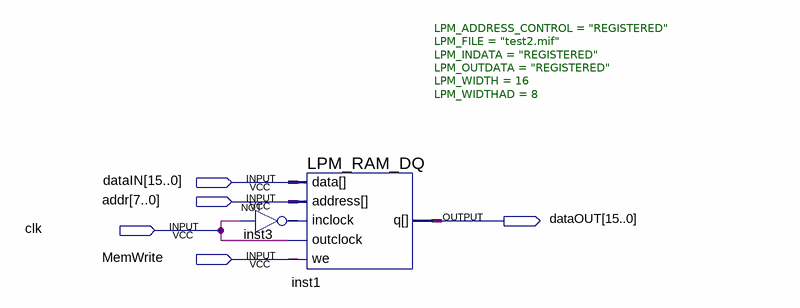
[diagram p0: schematic sheet]
// Quartus schematic Icache.bdf as structural Verilog: 2 symbols, 5 pins
module Icache (
  input  [15:0] dataIN,
  input  [7:0] addr,
  input  clk,
  input  MemWrite,
  output [15:0] dataOUT
);

  wire inst3_out;

  not inst3 (inst3_out, clk);
  LPM_RAM_DQ #(.LPM_ADDRESS_CONTROL("REGISTERED"), .LPM_FILE("test2.mif"), .LPM_INDATA("REGISTERED"), .LPM_OUTDATA("REGISTERED"), .LPM_WIDTH(16), .LPM_WIDTHAD(8)) inst1 (
    .inclock(inst3_out), .data(dataIN), .address(addr), .we(MemWrite), .outclock(clk), .q(dataOUT));
endmodule
